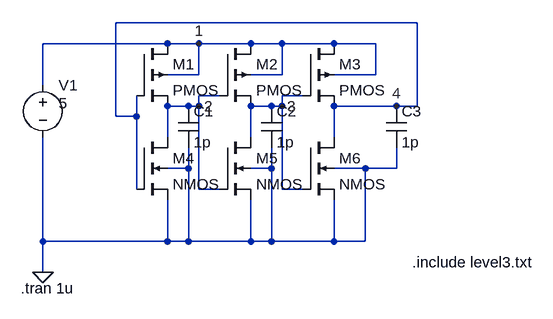
[diagram p0: schematic Ring_oscilator.asc]
Ring_oscilator.asc, the LTspice schematic file:
Version 4
SHEET 1 880 680
WIRE 528 80 64 80
WIRE 144 112 -48 112
WIRE 192 112 144 112
WIRE 272 112 192 112
WIRE 320 112 272 112
WIRE 400 112 320 112
WIRE 464 112 400 112
WIRE 192 160 192 112
WIRE 192 160 144 160
WIRE 320 160 320 112
WIRE 320 160 272 160
WIRE 464 160 464 112
WIRE 464 160 400 160
WIRE -48 176 -48 112
WIRE 224 192 192 192
WIRE 352 192 320 192
WIRE 176 208 144 208
WIRE 192 208 192 192
WIRE 192 208 176 208
WIRE 304 208 272 208
WIRE 320 208 320 192
WIRE 320 208 304 208
WIRE 496 208 400 208
WIRE 528 208 528 80
WIRE 528 208 496 208
WIRE 64 224 64 80
WIRE 96 224 96 192
WIRE 96 224 64 224
WIRE 144 256 144 208
WIRE 272 256 272 208
WIRE 400 256 400 208
WIRE 176 304 176 272
WIRE 176 304 144 304
WIRE 304 304 304 272
WIRE 304 304 272 304
WIRE 448 304 400 304
WIRE 496 304 496 272
WIRE 496 304 448 304
WIRE 96 336 96 224
WIRE 192 336 192 208
WIRE 224 336 192 336
WIRE 320 336 320 208
WIRE 352 336 320 336
WIRE -48 416 -48 256
WIRE 144 416 144 352
WIRE 144 416 -48 416
WIRE 176 416 176 304
WIRE 176 416 144 416
WIRE 272 416 272 352
WIRE 272 416 176 416
WIRE 304 416 304 304
WIRE 304 416 272 416
WIRE 400 416 400 352
WIRE 400 416 304 416
WIRE 448 416 448 304
WIRE 448 416 400 416
WIRE -48 464 -48 416
FLAG -48 464 0
FLAG 192 112 1
FLAG 192 208 2
FLAG 320 208 3
FLAG 496 208 4
SYMBOL pmos4 96 112 R0
SYMATTR InstName M1
SYMATTR Value2 l=2u w=8u
SYMBOL pmos4 224 112 R0
SYMATTR InstName M2
SYMATTR Value2 l=2u w=8u
SYMBOL pmos4 352 112 R0
SYMATTR InstName M3
SYMATTR Value2 l=2u w=8u
SYMBOL nmos4 96 256 R0
SYMATTR InstName M4
SYMATTR Value2 l=2u w=4u
SYMBOL nmos4 224 256 R0
SYMATTR InstName M5
SYMATTR Value2 l=2u w=4u
SYMBOL nmos4 352 256 R0
SYMATTR InstName M6
SYMATTR Value2 l=2u w=4u
SYMBOL voltage -48 160 R0
WINDOW 3 24 44 Left 2
WINDOW 123 0 0 Left 0
WINDOW 39 0 0 Left 0
SYMATTR InstName V1
SYMATTR Value 5
SYMBOL cap 160 208 R0
SYMATTR InstName C1
SYMATTR Value 1p
SYMBOL cap 288 208 R0
SYMATTR InstName C2
SYMATTR Value 1p
SYMBOL cap 480 208 R0
SYMATTR InstName C3
SYMATTR Value 1p
TEXT 520 448 Left 2 !.include level3.txt
TEXT -82 488 Left 2 !.tran 1u

The netlist it stands for:
* Ring_oscilator.asc
M1 1 4 2 1 PMOS l=2u w=8u
M2 1 2 3 1 PMOS l=2u w=8u
M3 1 3 4 1 PMOS l=2u w=8u
M4 2 4 0 0 NMOS l=2u w=4u
M5 3 2 0 0 NMOS l=2u w=4u
M6 4 3 0 0 NMOS l=2u w=4u
V1 1 0 5
C1 2 0 1p
C2 3 0 1p
C3 4 0 1p
.model NMOS NMOS
.model PMOS PMOS
.lib standard.mos
.include level3.txt
.tran 1u
.backanno
.end